# Altium schematic sheet Power_supply.SchDoc
size 368 x 223 mm
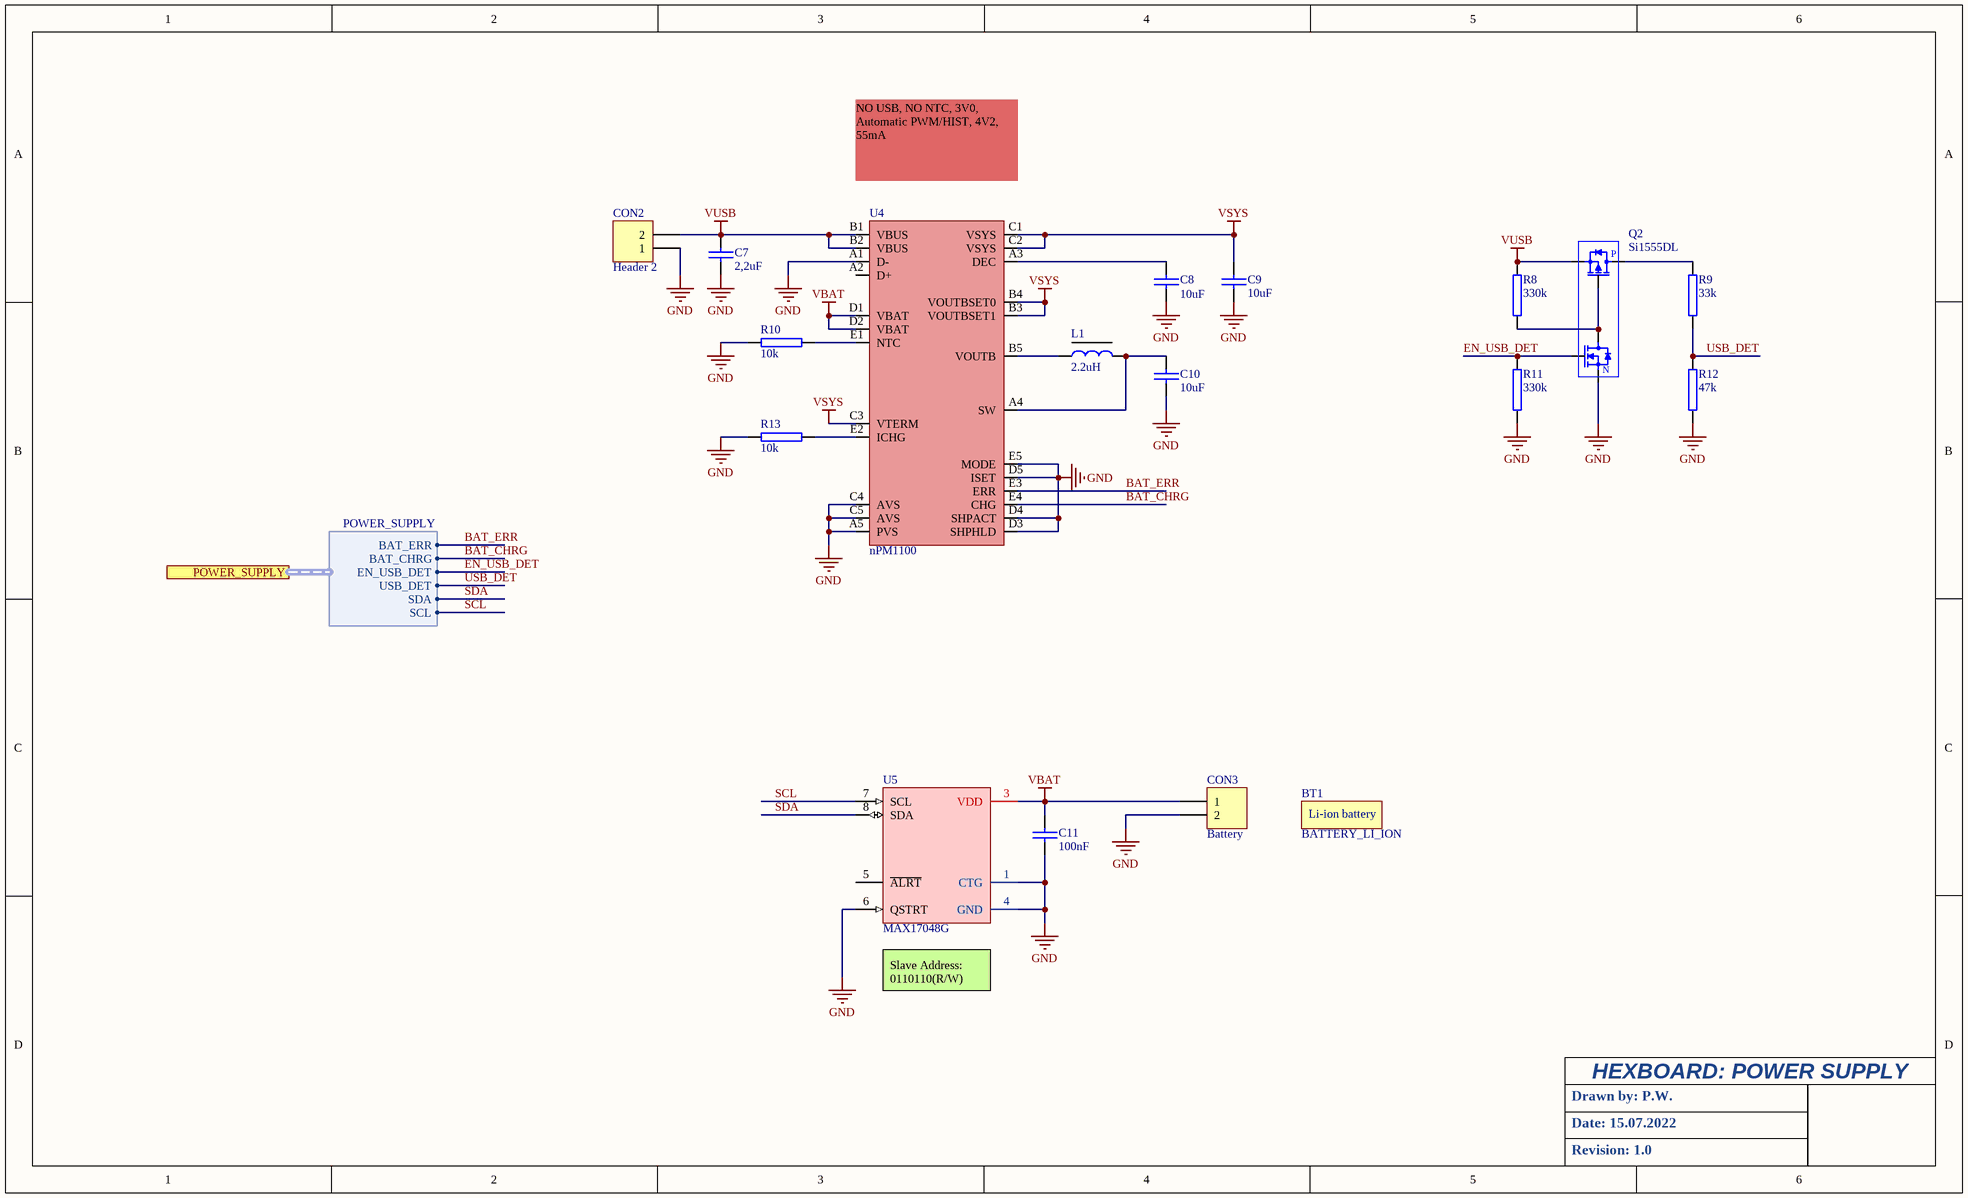
[diagram p0: Power_supply.SchDoc]

## Parts
BT1  BATTERY_LI_ION  [LI-ion battery 100mAh]
C7  2,2uF  [C0603L]
C8  10uF  [C0603L]
C9  10uF  [C0603L]
C10  10uF  [C0603L]
C11  100nF  [C0603L]
CON2  Header 2  [HDR1X2]
CON3  Battery  [HDR1X2_1mm27]
L1  2.2uH  [L0805]
Q2  Si1555DL  [SOT-363]
R8  330k  [1608[0603]]
R9  33k  [1608[0603]]
R10  10k  [1608[0603]]
R11  330k  [1608[0603]]
R12  47k  [1608[0603]]
R13  10k  [1608[0603]]
U4  nPM1100  [BGA25C40P5X5_207X207X52N]
U5  MAX17048G  [TDFN8_2x2x075]

## Ports
POWER_SUPPLY (harness POWER_SUPPLY)

## Harnesses
POWER_SUPPLY: BAT_ERR, BAT_CHRG, EN_USB_DET, SDA, SCL, USB_DET

## Nets
GND: C7.2 C8.2 C9.2 C10.2 C11.2 CON2.1 CON3.2 Q2.1(S1) R10.2 R11.1 R12.1 R13.2 U4.A1(D-) U4.A5(PVS) U4.C4(AVS) U4.C5(AVS) U4.D3(SHPHLD) U4.D4(SHPACT) U4.D5(ISET) U4.E5(MODE) U5.1(CTG) U5.4(GND) U5.6(QSTRT)
VBAT: C11.1 CON3.1 U4.D1(VBAT) U4.D2(VBAT) U5.3(VDD)
VSYS: C9.1 U4.B3(VOUTBSET1) U4.B4(VOUTBSET0) U4.C1(VSYS) U4.C2(VSYS) U4.C3(VTERM)
VUSB: C7.1 CON2.2 Q2.4(S2) R8.2 U4.B1(VBUS) U4.B2(VBUS)
BAT_CHRG: U4.E4(CHG) ; port POWER_SUPPLY.BAT_CHRG
BAT_ERR: U4.E3(ERR) ; port POWER_SUPPLY.BAT_ERR
EN_USB_DET: Q2.2(G1) R11.2 ; port POWER_SUPPLY.EN_USB_DET
SCL: U5.7(SCL) ; port POWER_SUPPLY.SCL
SDA: U5.8(SDA) ; port POWER_SUPPLY.SDA
USB_DET: R9.1 R12.2 ; port POWER_SUPPLY.USB_DET
NetC8_1: C8.1 U4.A3(DEC)
NetC10_1: C10.1 L1.2 U4.A4(SW)
NetL1_1: L1.1 U4.B5(VOUTB)
NetQ2_3: Q2.3(D2) R9.2
NetQ2_5: Q2.5(G2) Q2.6(D1) R8.1
NetR10_1: R10.1 U4.E1(NTC)
NetR13_1: R13.1 U4.E2(ICHG)

Not connected (* = marked no-connect by the designer): U4 A2(D+); U5 5(~{ALRT})

## Notes on the sheet
- NO USB, NO NTC, 3V0, Automatic PWM/HIST, 4V2, 55mA
- (near U5) Slave Address:
  0110110(R/W)
- HEXBOARD: POWER SUPPLY
- Drawn by: P.W.
- Date: 15.07.2022
- Revision: 1.0
- (in symbol BATTERY_LI_ION) Li-ion battery
- (in symbol Si1555DL) P; N

## Library data of the parts
BT1 = BATTERY_LI_ION: Battery
C7-C11 = CAP: Capacitor
CON2 CON3 = Header 2: Header, 2-Pin; LatestRevisionDate: 17-Jul-2002; LatestRevisionNote: Re-released for DXP Platform.; Publisher: Altium Limited
L1 = INDUCTOR
Q2 = Si1555DL: Montage: SMD; ComponentLink1Description: Datasheet; ComponentLink1URL: https://www.diodes.com/assets/Datasheets/ds30380.pdf
R8-R13 = RES
U4 = nPM1100: Integrated Power Managment IC
U5 = MAX17048G: 1-Cell/2-Cell Fuel Gauge with ModelGauge